# Altium project PCB_Project.PrjPcb
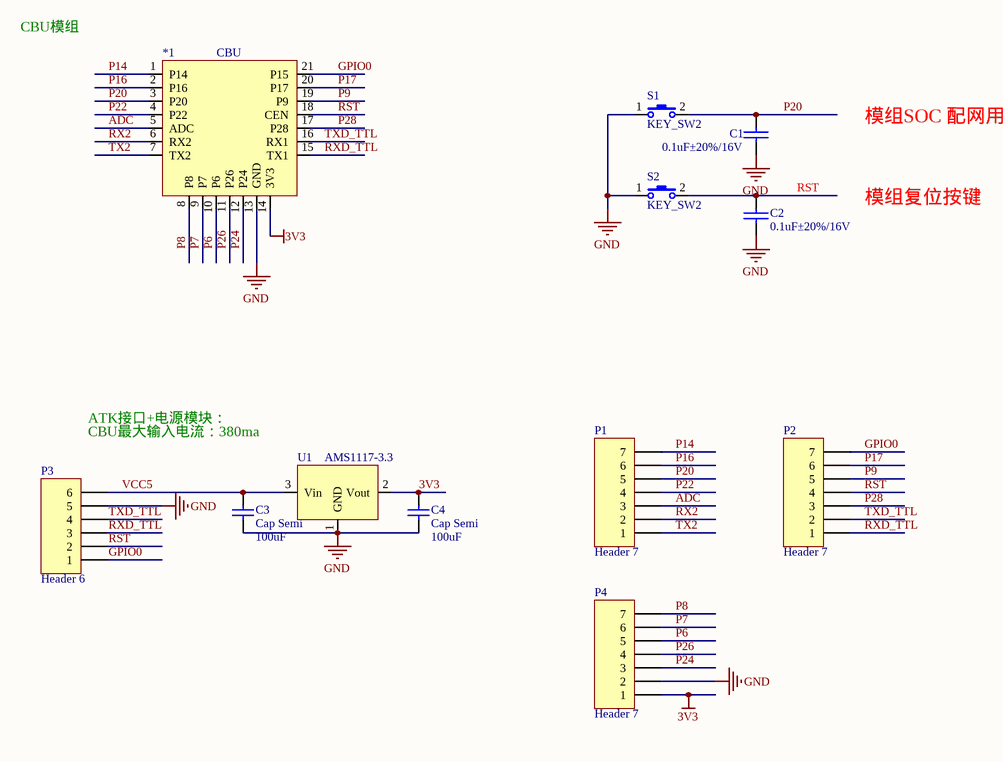
[diagram p0: CBU模块转8266封装.SchDoc]
2 sheets, 29 parts. Net scope: global (net labels, ports and power ports of the same name join across sheets).
Board files: PCB_幻彩灯带_2021-05-29.pcbdoc, CBU2ATK.PcbDoc
Sheets:
  CBU模块转8266封装.SchDoc
  最终原理图.SchDoc

## Sheet CBU模块转8266封装.SchDoc
size A4

### Parts
*1  CBU
C1  0.1uF±20%/16V  [C0603]
C2  0.1uF±20%/16V  [C0603]
C3  Cap Semi  value 100uF  [0402]
C4  Cap Semi  value 100uF  [0402]
P1  Header 7  [HDR1X7]
P2  Header 7  [HDR1X7]
P3  Header 6  [HDR1X6]
P4  Header 7  [HDR1X7]
S1  KEY_SW2  [KEY4-SMD]
S2  KEY_SW2  [KEY4-SMD]
U1  AMS1117-3.3  [SOT89]

### Nets
3V3: *1.14(3V3) C4.2 P4.1 U1.2(Vout)
GND: *1.13(GND) C1.1 C2.2 C3.1 C4.1 P3.5 P4.2 S1.1 S2.1 U1.1(GND)
ADC: *1.5(ADC) P1.3
GPIO0: *1.21(P15) P2.7 P3.1
P6: *1.10(P6) P4.5
P7: *1.9(P7) P4.6
P8: *1.8(P8) P4.7
P9: *1.19(P9) P2.5
P14: *1.1(P14) P1.7
P16: *1.2(P16) P1.6
P17: *1.20(P17) P2.6
P20: *1.3(P20) C1.2 P1.5 S1.2
P22: *1.4(P22) P1.4
P24: *1.12(P24) P4.3
P26: *1.11(P26) P4.4
P28: *1.17(P28) P2.3
RST: *1.18(CEN) C2.1 P2.4 P3.2 S2.2  [project net 3v3/gnd]
RX2: *1.6(RX2) P1.2
RXD_TTL: *1.15(TX1) P2.1 P3.3
TX2: *1.7(TX2) P1.1
TXD_TTL: *1.16(RX1) P2.2 P3.4
VCC5: C3.2 P3.6 U1.3(Vin)

### Notes on the sheet
- CBU模组
- 模组SOC 配网用按键
- 模组复位按键
- ATK接口+电源模块：
- CBU最大输入电流：380ma

### Library data of the parts
C1 C2 = CAP: Capacitor
C3 C4 = Cap Semi: Capacitor (Semiconductor SIM Model); Published: 8-Jun-2000; LatestRevisionDate: 29-May-2009; LatestRevisionNote: IPC-7351 Footprint Added.; PackageReference: C1206; Publisher: Altium Limited; PackageDescription: Chip Capacitor
P1 P2 P4 = Header 7: Header, 7-Pin; LatestRevisionDate: 17-Jul-2002; LatestRevisionNote: Re-released for DXP Platform.; Publisher: Altium Limited
P3 = Header 6: Header, 6-Pin; LatestRevisionDate: 17-Jul-2002; LatestRevisionNote: Re-released for DXP Platform.; Publisher: Altium Limited
U1 = AMS1117

## Sheet 最终原理图.SchDoc
size A3
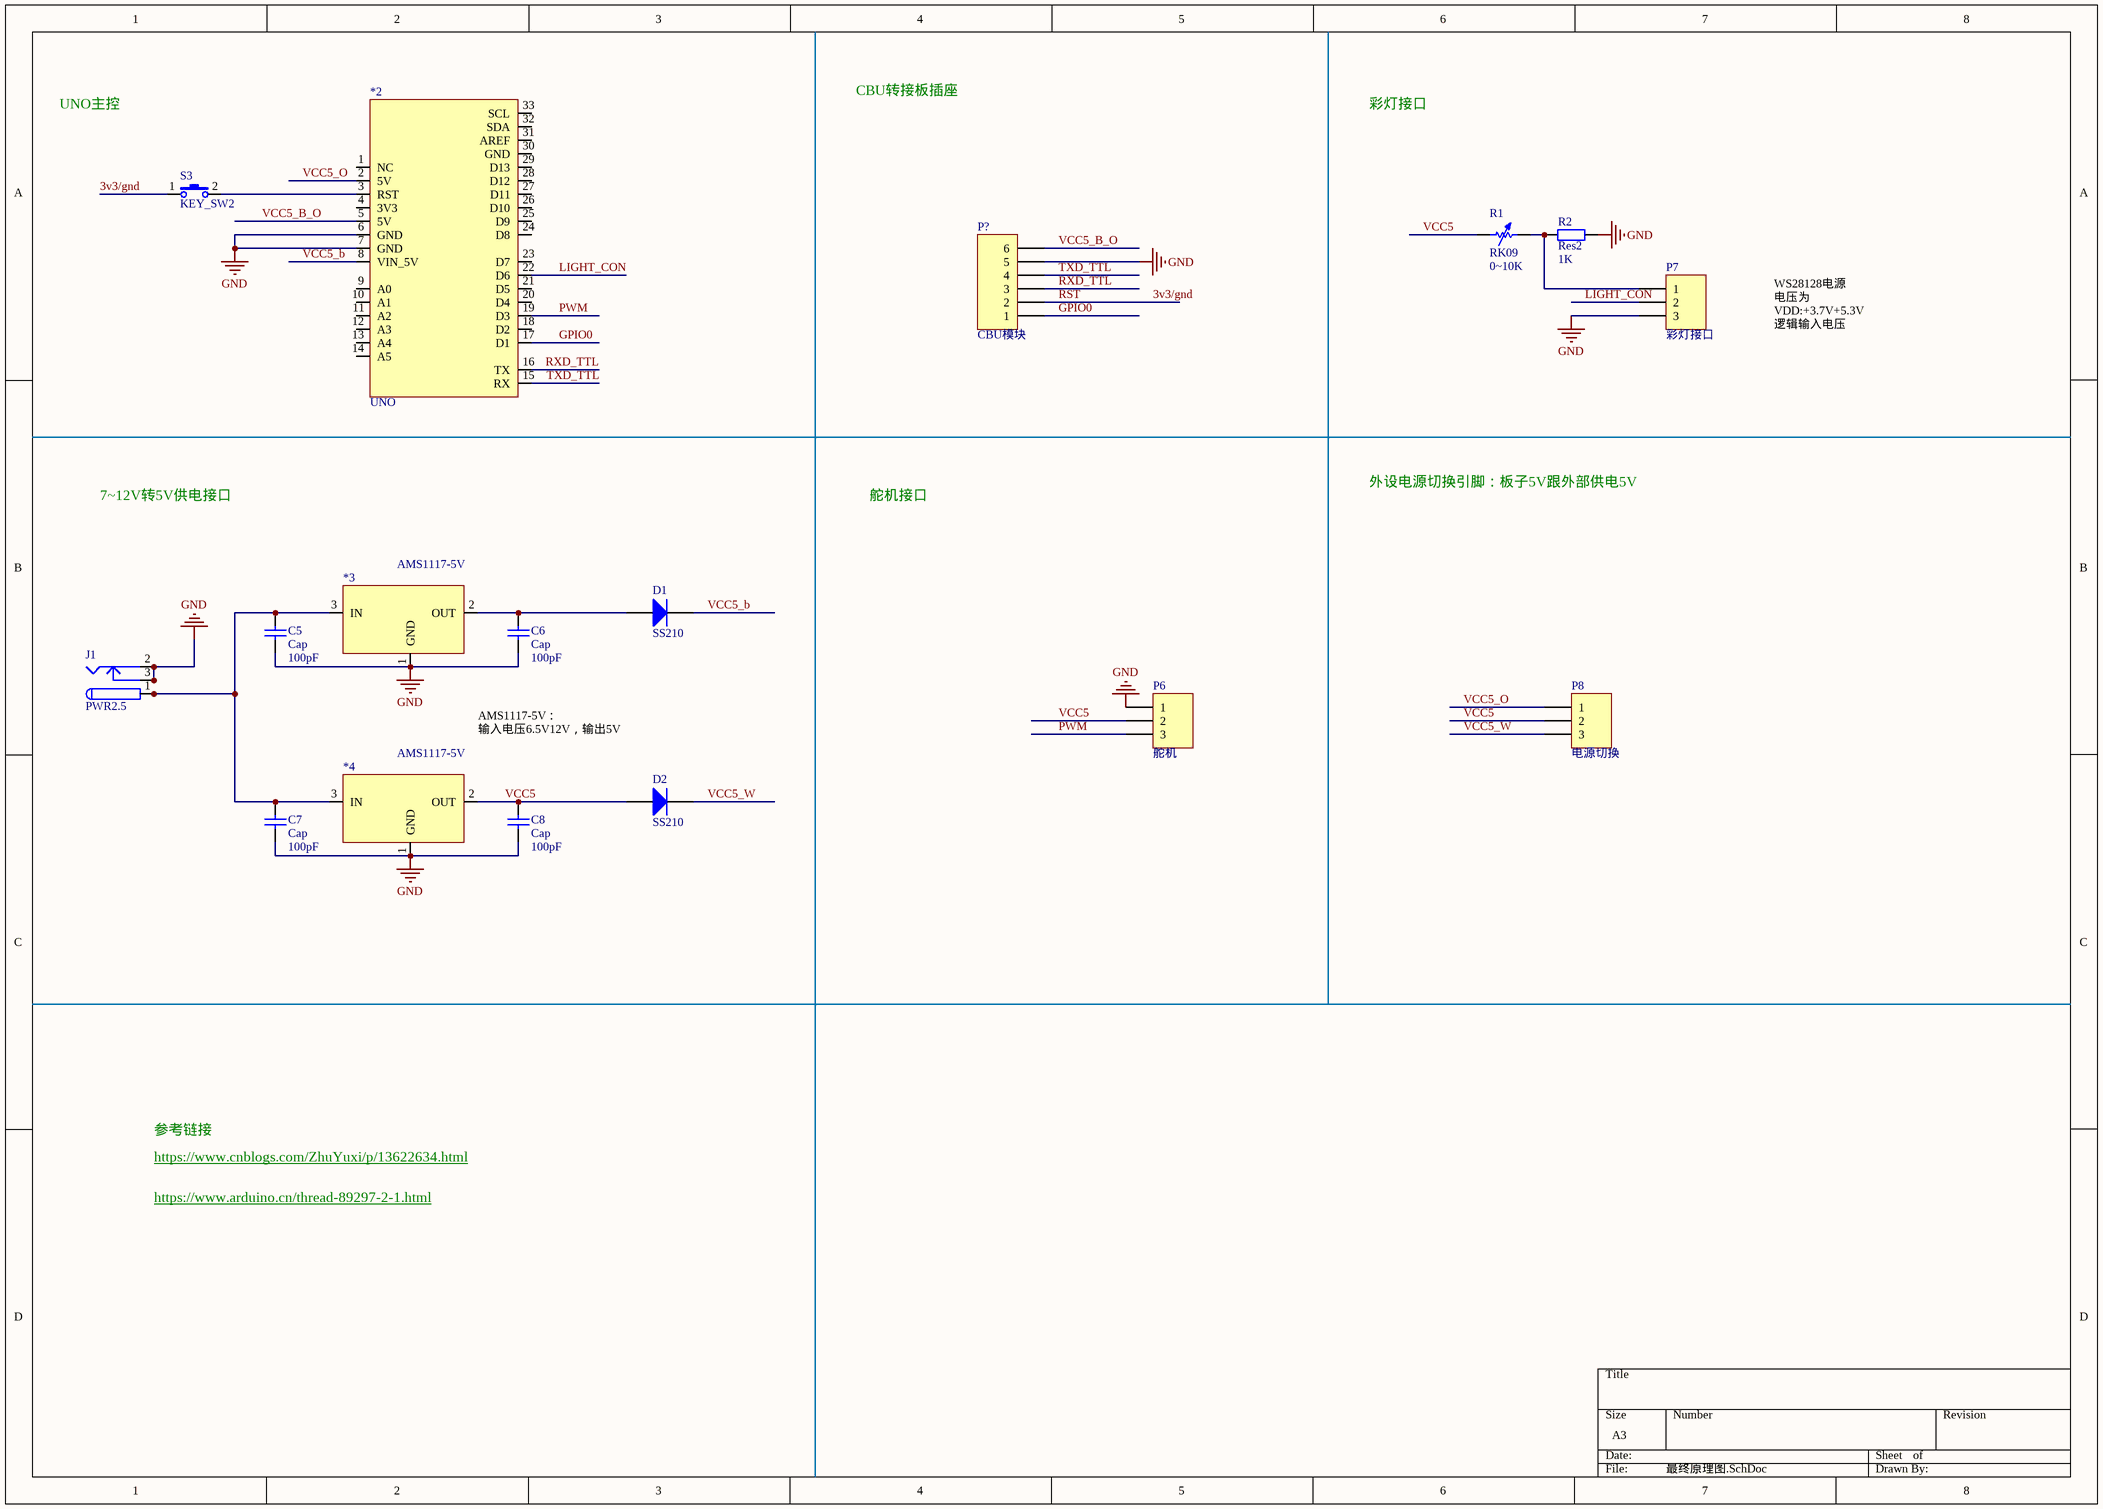
[diagram p1: 最终原理图.SchDoc]

### Parts
*2  UNO
*3  AMS1117-5V
*4  AMS1117-5V
C5  Cap  value 100pF  [RAD-0.3]
C6  Cap  value 100pF  [RAD-0.3]
C7  Cap  value 100pF  [RAD-0.3]
C8  Cap  value 100pF  [RAD-0.3]
D1  SS210  [SMC]
D2  SS210  [SMC]
J1  PWR2.5  [KLD-0202]
P6  舵机  [HDR1X3]
P7  彩灯接口  [HDR1X3]
P8  电源切换  [HDR1X3]
P?  CBU模块  [HDR1X6]
R1  RK09  value 0~10K  [AXIAL-0.7]
R2  Res2  value 1K  [AXIAL-0.4]
S3  KEY_SW2  [KEY4-SMD]

### Nets
GND: *2.6(GND) *2.7(GND) *3.1(GND) *4.1(GND) C5.1 C6.1 C7.1 C8.1 J1.2 J1.2A J1.2B J1.3 J1.3A J1.3B P6.1 P7.3 P?.5 R2.2
3v3/gnd: P?.2 S3.1  [also labelled RST]
GPIO0: *2.17(D1) P?.1
LIGHT_CON: *2.22(D6) P7.2
PWM: *2.19(D3) P6.3
RXD_TTL: *2.16(TX) P?.3
TXD_TTL: *2.15(RX) P?.4
VCC5: *4.2(OUT) C8.2 D2.1(A) P6.2 P8.2 R1.1
VCC5_b: *2.8(VIN_5V) D1.2(K)
VCC5_B_O: *2.5(5V) P?.6
VCC5_O: *2.2(5V) P8.1
VCC5_W: D2.2(K) P8.3
Net*2_3: *2.3(RST) S3.2
Net*3_2: *3.2(OUT) C6.2 D1.1(A)
Net*3_3: *3.3(IN) *4.3(IN) C5.2 C7.2 J1.1 J1.1A J1.1B
NetP7_1: P7.1 R1.2 R2.1

Not connected (* = marked no-connect by the designer): *2 1(NC) 4(3V3) 9(A0) 10(A1) 11(A2) 12(A3) 13(A4) 14(A5) 18(D2) 20(D4) 21(D5) 23(D7) 24(D8) 25(D9) 26(D10) 27(D11) 28(D12) 29(D13) 30(GND) 31(AREF) 32(SDA) 33(SCL)

### Notes on the sheet
- UNO主控
- CBU转接板插座
- 彩灯接口
- WS28128电源电压为VDD:+3.7V+5.3V
  逻辑输入电压为-0.3VVDD+0.7V
- 7~12V转5V供电接口
- 舵机接口
- 外设电源切换引脚：板子5V跟外部供电5V
- AMS1117-5V：
  输入电压6.5V12V，输出5V
- 参考链接
- https://www.cnblogs.com/ZhuYuxi/p/13622634.html
- https://www.arduino.cn/thread-89297-2-1.html

### Library data of the parts
C5-C8 = Cap: Capacitor; Published: 8-Jun-2000; LatestRevisionDate: 17-Jul-2002; LatestRevisionNote: Re-released for DXP Platform.; PackageReference: RAD-0.3; Publisher: Altium Limited; PackageDescription: Radial Cap, Thru-Hole; 2 Leads; 0.3 in Pin Spacing
D1 D2 = Diode: Default Diode; Published: 8-Jun-2000; LatestRevisionDate: 17-Jul-2002; LatestRevisionNote: Re-released for DXP Platform.; PackageVersion: Sep-1996; PackageReference: SMC; Publisher: Altium Limited; PackageDescription: DO-214-AB/SMC; 2 C-Bend Leads; Body 7.9 x 5.9 mm, inc. leads (LxW); Code_JEDEC: DO-214-AB
J1 = PWR2.5: Low Voltage Power Supply Connector; Published: 17-Dec-2003; DatasheetDocument: 09-May-2002; Publisher: Altium Limited; ComponentLink1Description: Manufacturer Link; ComponentLink1URL: http://domino.kycon.com/internet/Products.html
P6-P8 = Header 3: Header, 3-Pin; LatestRevisionDate: 17-Jul-2002; LatestRevisionNote: Re-released for DXP Platform.; Publisher: Altium Limited
P? = Header 6: Header, 6-Pin; LatestRevisionDate: 17-Jul-2002; LatestRevisionNote: Re-released for DXP Platform.; Publisher: Altium Limited
R1 = Res Adj1: Variable Resistor; Set Position: 0.5; Published: 8-Jun-2000; LatestRevisionDate: 17-Jul-2002; LatestRevisionNote: Re-released for DXP Platform.; PackageReference: AXIAL-0.7; Publisher: Altium Limited; PackageDescription: Axial Device, Thru-Hole; 2 Leads; 0.7 in Pin Spacing
R2 = Res2: Resistor; Published: 8-Jun-2000; LatestRevisionDate: 17-Jul-2002; LatestRevisionNote: Re-released for DXP Platform.; PackageReference: AXIAL-0.4; Publisher: Altium Limited; PackageDescription: Axial Device, Thru-Hole; 2 Leads; 0.4 in Pin Spacing

## Nets that join several sheets
GND: CBU模块转8266封装 (10 pins), 最终原理图 (18 pins)
3v3/gnd: CBU模块转8266封装 (5 pins), 最终原理图 (P?.2 S3.1)
GPIO0: CBU模块转8266封装 (*1.21 P2.7 P3.1), 最终原理图 (*2.17 P?.1)
RXD_TTL: CBU模块转8266封装 (*1.15 P2.1 P3.3), 最终原理图 (*2.16 P?.3)
TXD_TTL: CBU模块转8266封装 (*1.16 P2.2 P3.4), 最终原理图 (*2.15 P?.4)
VCC5: CBU模块转8266封装 (C3.2 P3.6 U1.3), 最终原理图 (6 pins)